# EasyEDA Pro project ProPrj_BSPD_2026-01-23.epro

# Schematic Schematic1
Board Name: Board1; Create Date: 2025-12-20; Page Name: P1; Project Name: BSPD; Schematic Name: Schematic1; Update Date: 2026-01-04; BladeWidth: 10; Company: 嘉立创EDA; Page Size: A4; RegionStart: 1; ShowBorder: 1; TitleBlock: 1; TitleBlockPosition: 3; Version: V1.0; XRegionCount: 6; YRegionCount: 4
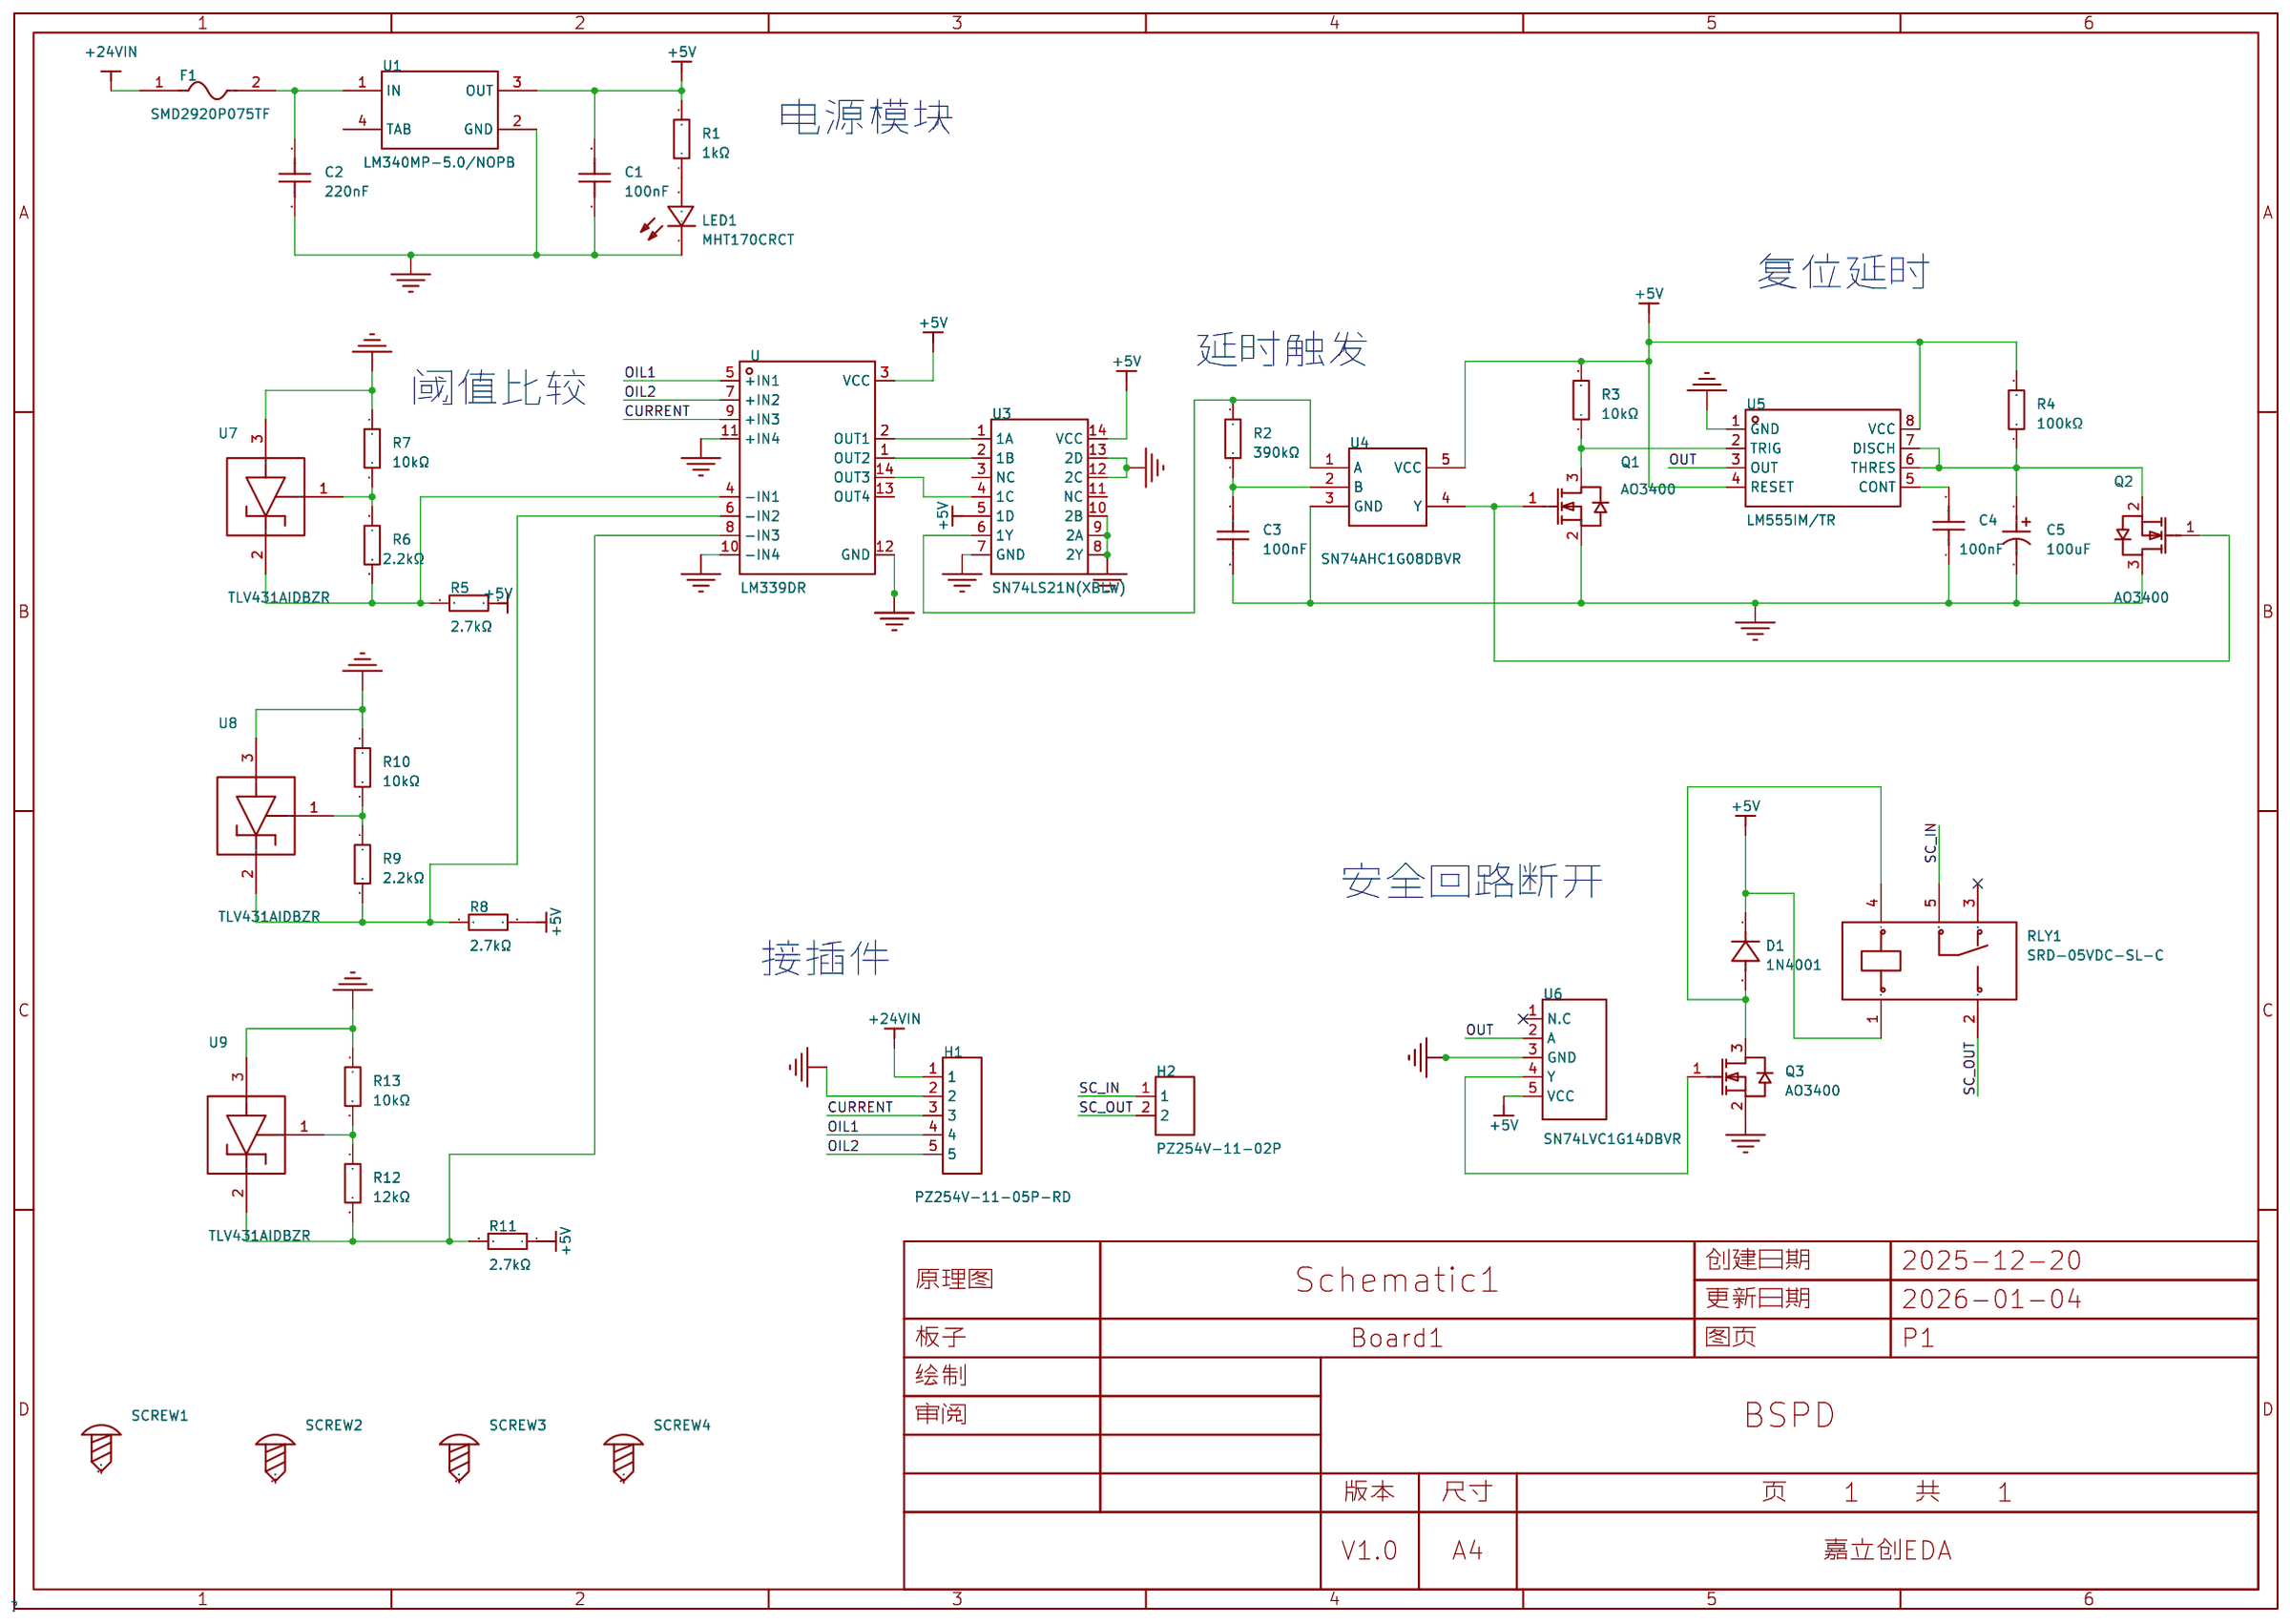
[diagram p0: schematic sheet]

## Parts
C1  100nF  [C0603]
C2  220nF  [C0603]
C3  100nF  [C0603]
C4  100nF  [C0603]
C5  100uF  [CAP-SMD_BD6.3-L6.6-W6.6-FD-1]
D1  1N4001  [SMA_L4.3-W2.5-LS5.0-RD]
F1  SMD2920P075TF  [F2920]
H1  PZ254V-11-05P-RD  [HDR-TH_5P-P2.54-V-M]
H2  PZ254V-11-02P  [HDR-TH_2P-P2.54-V-M]
LED1  MHT170CRCT  [LED0805-RD]
Q1  AO3400  [SOT-23_L2.9-W1.3-P1.90-LS2.4-BR]
Q2  AO3400  [SOT-23_L2.9-W1.3-P1.90-LS2.4-BR]
Q3  AO3400  [SOT-23_L2.9-W1.3-P1.90-LS2.4-BR]
R1  1kΩ  [R0603]
R2  390kΩ  [R0603]
R3  10kΩ  [R0603]
R4  100kΩ  [R0603]
R5  2.7kΩ  [R0603]
R6  2.2kΩ  [R0603]
R7  10kΩ  [R0603]
R8  2.7kΩ  [R0603]
R9  2.2kΩ  [R0603]
R10  10kΩ  [R0603]
R11  2.7kΩ  [R0603]
R12  12kΩ  [R0603]
R13  10kΩ  [R0603]
RLY1  SRD-05VDC-SL-C  [RELAY-TH_SRD-XXVDC-XL-C]
SCREW1  -  [M2螺丝]
SCREW2  -  [M2螺丝]
SCREW3  -  [M2螺丝]
SCREW4  -  [M2螺丝]
U  LM339DR  [SOIC-14_L8.7-W3.9-P1.27-LS6.0-BL]
U1  LM340MP-5.0/NOPB  [SOT-223_L6.5-W3.5-P2.30-LS7.0-BR]
U3  SN74LS21N(XBLW)  [DIP-14_L19.0-W6.4-P2.54-LS7.6-BL]
U4  SN74AHC1G08DBVR  [SOT-23-5_L3.0-W1.7-P0.95-LS2.8-BR]
U5  LM555IM/TR  [SOIC-8_L4.9-W3.9-P1.27-LS6.0-BL]
U6  SN74LVC1G14DBVR  [SOT-23-5_L3.0-W1.7-P0.95-LS2.8-BR]
U7  TLV431AIDBZR  [SOT-23-3_L2.9-W1.3-P1.90-LS2.4-BR]
U8  TLV431AIDBZR  [SOT-23-3_L2.9-W1.3-P1.90-LS2.4-BR]
U9  TLV431AIDBZR  [SOT-23-3_L2.9-W1.3-P1.90-LS2.4-BR]

## Library data of the parts
C1-C4 = CGA0603X7R104K500JT: 容值:100nF;精度:±10%;额定电压:50V;温度系数:X7R;; LCSC Part Name: 100nF ±10% 50V; Supplier Part: C6119867; Manufacturer: HRE(芯声); Supplier Footprint: 0603; JLCPCB Part Class: 扩展库; Datasheet: https://item.szlcsc.com/datasheet/CGA0603X7R104K500JT/7062573.html; Supplier: LCSC; Tolerance: ±10%; Voltage Rating: 50V; Temperature Coefficient: X7R
C5 = JVJ25V100M6x5: 容值:100uF;精度:±20%;额定电压:25V;纹波电流:72mA@120Hz;; LCSC Part Name: 100uF ±20% 25V; Supplier Part: C46550402; Manufacturer: JIERR(捷而瑞); Supplier Footprint: SMD,D6.3xL5.4mm; JLCPCB Part Class: 扩展库; Datasheet: https://item.szlcsc.com/datasheet/JVJ25V100M6x5/48680096.html; Supplier: LCSC; Tolerance: ±20%; Voltage Rating: 25V; Ripple Current: 72mA@120Hz; Diameter: 6.3mm; Height - Seated (Max): 5.4mm; Lifetime: 2000hrs@105℃; Operating Temperature: -55℃~+105℃
D1 = 1N4001_C727079: 二极管配置:独立式;正向压降(Vf):1.1V@1A;直流反向耐压(Vr):50V;整流电流:1A;; Supplier Part: C727079; Manufacturer: TWGMC(迪嘉); Supplier Footprint: SMA(DO-214AC); JLCPCB Part Class: 扩展库; Datasheet: https://item.szlcsc.com/datasheet/1N4001/774184.html; Supplier: LCSC; Diode Configuration: 独立式; Voltage - Forward(Vf@If): 1.1V@1A; Voltage - DC Reverse(Vr): 50V; Current - Rectified: 1A; Reverse Leakage Current (Ir): 5uA
F1 = SMD2920P075TF_C20822: 耐压(Vmax):33V;最大电流(Imax):40A;保持电流(Ihold):750mA;跳闸电流(Itrip):1.5A;; LCSC Part Name: 30V 750mA 2920自恢复; Supplier Part: C20822; Manufacturer: RUILON(瑞隆源); Supplier Footprint: 2920; JLCPCB Part Class: 扩展库; Datasheet: https://item.szlcsc.com/datasheet/SMD2920P075TF/21534.html; Supplier: LCSC; Voltage - Max: 33V; Current - Max: 40A; Hold Current: 750mA; Trip Current: 1.5A; Time to Trip(Max): 300ms; Operating Temperature: -40℃~+85℃; Length: 7.98mm; Width: 5.44mm; Height: 1.3mm
H1 = PZ254V-11-05P-RD: 插针结构:1x5P;间距:2.54mm;圆针/方针:方针;安装方式:直插;排数:单排;总PIN位数:5P;额定电流:3A;配合针长度:6.1mm;塑高:2.5mm;端接针长度:3mm;触头材质:黄铜;工作温度:-40℃~+105℃;颜色:红色;; LCSC Part Name: 1x5P 间距:2.54mm 方针 直插; Supplier Part: C41425295; Manufacturer: XFCN(兴飞); Supplier Footprint: 插件,P=2.54mm; JLCPCB Part Class: 扩展库; Datasheet: https://item.szlcsc.com/datasheet/PZ254V-11-05P-RD/43268212.html; Supplier: LCSC; Pin Structure: 1x5P; Pitch: 2.54mm; Circluar Pins/Square Pins: 方针; Mounting Type: 直插; Number of Rows: 单排; Number of Pins: 5P; Current Rating: 3A; Length of Mating Pin: 6.1mm; Insulation Height: 2.5mm; Length of End Connection Pin: 3mm; Contact Material: 黄铜; Operating Temperature: -40℃~+105℃; Color: 红色
H2 = PZ254V-11-02P: 插针结构:1x2P;间距:2.54mm;行距:-;圆针/方针:方针;安装方式:直插;排数:单排;总PIN位数:2P;额定电流:-;额定电压:-;配合针长度:6mm;塑高:2.5mm;端接针长度:3mm;触头材质:黄铜;触头镀层:-;工作温度:-40℃~+105℃;颜色:黑色;; LCSC Part Name: 1x2P 间距:2.54mm 方针 直插; Supplier Part: C492401; Manufacturer: XFCN(兴飞); Supplier Footprint: 插件,P=2.54mm; JLCPCB Part Class: 扩展库; Datasheet: https://item.szlcsc.com/datasheet/PZ254V-11-02P/502957.html; Supplier: LCSC; Pin Structure: 1x2P; Pitch: 2.54mm; Circluar Pins/Square Pins: 方针; Mounting Type: 直插; Number of Rows: 单排; Number of Pins: 2P; Length of Mating Pin: 6mm; Insulation Height: 2.5mm; Length of End Connection Pin: 3mm; Contact Material: 黄铜; Operating Temperature: -40℃~+105℃; Color: 黑色
LED1 = MHT170CRCT: 发光颜色:红色;功率:60mW；40mW;正向电流:20mA;主波长:617.5nm~633.5nm;二极管配置:-;透镜颜色:无色透明透镜;色温:-;发光角度:140°;载带方式:-;工作温度:-40℃~+85℃;; LCSC Part Name: 红灯; Supplier Part: C389523; Manufacturer: MEIHUA(美华); Supplier Footprint: 0805; JLCPCB Part Class: 扩展库; Datasheet: https://atta.szlcsc.com/upload/public/pdf/source/20190515/C389523_83CDF1F865E0603B87BA4637FE3B16EE.pdf; Supplier: LCSC; Emitted Color: 红色; Power Dissipation: 60mW；40mW; Forward Current: 20mA; Dominant Wavelength: 617.5nm~633.5nm; Peak Wavelength: 632nm; Lens Color: 无色透明透镜; Viewing Angle: 140°; Operating Temperature: -40℃~+85℃
Q1-Q3 = AO3400_C2938367: 数量:1个N沟道;漏源电压(Vdss):30V;连续漏极电流(Id):5.8A;导通电阻(RDS(on)):28mΩ@10V;耗散功率(Pd):1.5W;阈值电压(Vgs(th)):1.4V@250uA;; LCSC Part Name: 1个N沟道 耐压:30V 电流:5.8A; Supplier Part: C2938367; Manufacturer: GOODWORK(固得沃克); Supplier Footprint: SOT-23; JLCPCB Part Class: 扩展库; Datasheet: https://item.szlcsc.com/datasheet/AO3400/3294704.html; Supplier: LCSC; Number: 1个N沟道; Drain to Source Voltage: 30V; Current - Continuous Drain(Id): 5.8A; RDS(on): 28mΩ@10V; Pd - Power Dissipation: 1.5W; Gate Threshold Voltage (Vgs(th)): 1.4V@250uA; Input Capacitance(Ciss): 1.05nF; Reverse Transfer Capacitance (Crss@Vds): 77pF@15V; Operating Temperature: -55℃~+150℃; Type: N沟道
R1-R3 R5-R13 = 0603WAF1002T5E: 电阻类型:厚膜电阻;阻值:10kΩ;精度:±1%;功率:100mW;工作电压:75V;温度系数:±100ppm/℃;; LCSC Part Name: 厚膜电阻 10kΩ ±1% 100mW; Supplier Part: C25804; Manufacturer: UNI-ROYAL(厚声); Supplier Footprint: 0603; JLCPCB Part Class: 基础库; Datasheet: https://item.szlcsc.com/datasheet/0603WAF1002T5E/26547.html; Supplier: LCSC; Type: 厚膜电阻; Tolerance: ±1%; Power(Watts): 100mW; Voltage-Supply(Max): 75V; Temperature Coefficient: ±100ppm/℃; Operating Temperature: -55℃~+155℃
R4 = 0603WAF1003T5E: 电阻类型:厚膜电阻;阻值:100kΩ;精度:±1%;功率:100mW;工作电压:75V;温度系数:±100ppm/℃;; LCSC Part Name: 100kΩ ±1% 100mW 厚膜电阻; Supplier Part: C25803; Manufacturer: UNI-ROYAL(厚声); Supplier Footprint: 0603; JLCPCB Part Class: 基础库; Datasheet: https://item.szlcsc.com/datasheet/0603WAF1003T5E/26546.html; Supplier: LCSC; Type: 厚膜电阻; Tolerance: ±1%; Power(Watts): 100mW; Voltage-Supply(Max): 75V; Temperature Coefficient: ±100ppm/℃; Operating Temperature: -55℃~+155℃
RLY1 = SRD-05VDC-SL-C: 线圈电压:5V;触点形式:一组转换:1C(单刀双掷-转换);触点容量(电阻负载):-;最大切换电压:250V@AC;最大切换电流:15A;; LCSC Part Name: 蓝色 单组转换型继电器; Supplier Part: C35449; Manufacturer: 松乐; Supplier Footprint: 插件,15.6x19.2mm; JLCPCB Part Class: 扩展库; Datasheet: https://item.szlcsc.com/datasheet/SRD-05VDC-SL-C/36422.html; Supplier: LCSC; Coil Voltage: 5V; Contact Form: 一组转换:1C(单刀双掷-转换); Number of Pins: 5; Switching Voltage(Max): 250V@AC; Coil Rated Power: 360mW; Switching Current(Max): 15A; Coil Type: 无极性-单线圈; Coil Resistance: 70Ω; Contact Resistance: 100mΩ; Operate Time: 10ms; Release Time: 10ms
SCREW1-SCREW4 = M2螺丝: Supplier Footprint: 插件
U = LM339DR_C5236695: 比较器数:四路;输入失调电压(Vos):2mV;输入偏置电流(Ib):25nA;; Supplier Part: C5236695; Manufacturer: UMW(友台半导体); Supplier Footprint: SOP-14; JLCPCB Part Class: 扩展库; Datasheet: https://item.szlcsc.com/datasheet/LM339DR/5939954.html; Supplier: LCSC; Number of Channels: 四路; Vos - Input Offset Voltage: 2mV; Ib - Input Bias Current: 25nA; Propagation Delay Time: 300ns; Output Mode: TTL；CMOS; Quiescent Current: 800uA; Operating Temperature: 0℃~+70℃; Maximum Power Supply Range (Vdd-Vss): 36V; Single Supply: 2V~36V; Dual Supply: 1V~18V；-18V~-1V; Input Offset Current(Ios): 5nA; Response Time (tr): 1.3us
U1 = LM340MP-5.0/NOPB: 输出类型:固定;工作电压:35V;输出电压:5V;输出电流:1A;电源纹波抑制比(PSRR):70dB@(120Hz);输出极性:正极;; LCSC Part Name: 1.5A、35V 线性稳压器; Supplier Part: C131990; Manufacturer: TI(德州仪器); Supplier Footprint: SOT-223; JLCPCB Part Class: 扩展库; Datasheet: https://www.ti.com/cn/lit/gpn/lm340; Supplier: LCSC; Output Type: 固定; Voltage - Supply: 35V; Output Voltage: 5V; Output Current: 1A; Power Supply Rejection Ratio (PSRR): 70dB@(120Hz); Voltage Dropout: 2V@(1A); standby current: 8mA; Noise: 40uV; Features: 短路保护；过热保护；过流保护; Operating Temperature: 0℃~+125℃; Output Configuration: 正极; Number of Outputs: 1
U3 = SN74LS21N(XBLW): 逻辑类型:与门;通道数:2;工作电压:2V~6V;静态电流(Iq):20uA;传播延迟(tpd):19ns@6.0V,50pF;; LCSC Part Name: 双路四输入与门; Supplier Part: C42395511; Manufacturer: XBLW(芯伯乐); Supplier Footprint: DIP-14; JLCPCB Part Class: Extended Part; Datasheet: https://item.szlcsc.com/datasheet/SN74LS21N(XBLW)/44341345.html; Supplier: LCSC; Logic Type: 与门; Number of Channels: 2; Voltage - Supply: 2V~6V; Quiescent Current: 20uA; Current - Output Low(IOL): 5.2mA; Current - Output High(IOH): 5.2mA; Input Logic Level - High: 1.5V；4.2V；3.15V; Input Logic Level - Low: 500mV；1.35V；1.8V; Output Logic Level - High: 1.9V；5.48V；3.98V; Output Logic Level - Low: 100mV；330mV；330mV; Series: 74LS; Propagation Delay: 19ns@6.0V,50pF; Operating Temperature: -20℃~+85℃; Input Number: 4
U4 = SN74AHC1G08DBVR: 逻辑类型:与门;通道数:1;工作电压:2V~5.5V;静态电流(Iq):1uA;传播延迟(tpd):7.9ns@5V,50pF;; Supplier Part: C7467; Manufacturer: TI(德州仪器); Supplier Footprint: SOT-23-5; JLCPCB Part Class: 扩展库; Datasheet: https://www.ti.com/cn/lit/gpn/sn74ahc1g08; Supplier: LCSC; Logic Type: 与门; Number of Channels: 1; Voltage - Supply: 2V~5.5V; Quiescent Current: 1uA; Current - Output Low(IOL): 8mA; Current - Output High(IOH): 8mA; Input Logic Level - High: 1.5V~3.85V; Input Logic Level - Low: 500mV~1.65V; Series: 74AHC系列; Propagation Delay: 7.9ns@5V,50pF; Operating Temperature: -55℃~+125℃
U5 = LM555IM/TR: 定时器/计时器/时钟振荡器  高精度定时脉冲的双极性集成电路; Supplier Part: C19193454; Manufacturer: HGSEMI(华冠); Supplier Footprint: SOP-8; JLCPCB Part Class: Extended Part; Datasheet: https://item.szlcsc.com/datasheet/LM555IM%252FTR/20442266.html; Supplier: LCSC
U6 = SN74LVC1G14DBVR: 输入类型:施密特触发器;工作电压:1.65V~5.5V;工作电流:10uA;通道数:1;传播延迟(tpd):6.5ns@2.5V,50pF;; LCSC Part Name: 单路施密特触发反相器; Supplier Part: C7835; Manufacturer: TI(德州仪器); Supplier Footprint: SOT-23-5; JLCPCB Part Class: 扩展库; Datasheet: https://www.ti.com/cn/lit/gpn/sn74lvc1g14; Supplier: LCSC; Input Type: 施密特触发器; Voltage - Supply: 1.65V~5.5V; Current - Supply: 10uA; Number of Circuits: 1; Number of Inputs: 1; Current - Output Low(IOL): 32mA; Current - Output High(IOH): 32mA; Input Logic Level - High: 1.16V~3.33V; Input Logic Level -Low: 390mV~1.87V; Max Propagation Delay: 6.5ns@2.5V,50pF; Series: 74LVC系列
U7-U9 = TLV431AIDBZR: 输出类型:可调;输出电压:1.24V~6V;输出电流:15mA;精度:±1%;; LCSC Part Name: 低压可调精密并联稳压器; Supplier Part: C56765; Manufacturer: TI(德州仪器); Supplier Footprint: SOT-23; JLCPCB Part Class: 扩展库; Datasheet: https://www.ti.com/cn/lit/gpn/tlv431a; Supplier: LCSC; Output Type: 可调; Output Voltage: 1.24V~6V; Output Current: 15mA; Tolerance: ±1%; Reference Type: 并联; Minimum Cathode Current for Regulation: 100uA; Operating Temperature: -40℃~+85℃

## Nets
+5V: C1.2 D1.1(K) R1.2 R3.2 R4.2 R5.1 R8.1 R11.1 RLY1.1 U.3(VCC) U1.3(OUT) U3.5(1D) U3.14(VCC) U4.5(VCC) U5.4(RESET) U5.8(VCC) U6.5(VCC)
+24VIN: F1.1 H1.1
GND: C1.1 C2.2 C3.2 C4.1 C5.2 H1.2 LED1.1(-) Q1.2(S) Q2.3(D) Q3.2(S) R7.1 R10.1 R13.1 U.10(-IN4) U.11(+IN4) U.12(GND) U1.2(GND) U3.7(GND) U3.8(2Y) U3.9(2A) U3.10(2B) U3.12(2C) U3.13(2D) U4.3(GND) U5.1(GND) U6.3(GND) U7.3(A) U8.3(A) U9.3(A)
CURRENT: H1.3 U.9(+IN3)
OIL1: H1.4 U.5(+IN1)
OIL2: H1.5 U.7(+IN2)
OUT: U5.3(OUT) U6.2(A)
SC_IN: H2.1 RLY1.5
SC_OUT: H2.2 RLY1.2
$1N394: C2.1 F1.2 U1.1(IN)
$1N3641: U.2(OUT1) U3.1(1A)
$1N3645: U.1(OUT2) U3.2(1B)
$1N3650: U.14(OUT3) U3.4(1C)
$1N3824: R2.2 U3.6(1Y) U4.1(A)
$1N4014: LED1.2(+) R1.1
$1N4204: C3.1 R2.1 U4.2(B)
$1N5455: Q1.3(D) R3.1 U5.2(TRIG)
$1N5481: Q1.1(G) Q2.1(G) U4.4(Y)
$1N5592: C5.1 Q2.2(S) R4.1 U5.6(THRES) U5.7(DISCH)
$1N5609: C4.2 U5.5(CONT)
$1N6118: Q3.1(G) U6.4(Y)
$1N6220: D1.2(A) Q3.3(D) RLY1.4
$1N7976: R6.1 R7.2 U7.1(REF)
$1N8357: R5.2 R6.2 U.4(-IN1) U7.2(C)
$1N8749: R11.2 R12.2 U.8(-IN3) U9.2(C)
$1N11432: R8.2 R9.2 U.6(-IN2) U8.2(C)
$1N11437: R9.1 R10.2 U8.1(REF)
$1N11462: R12.1 R13.2 U9.1(REF)

Not connected (* = marked no-connect by the designer): RLY1 3*; SCREW1 1; SCREW2 1; SCREW3 1; SCREW4 1; U 13(OUT4); U1 4(TAB); U3 3(NC) 11(NC); U6 1(N.C)*

## Notes on the sheet
- 电源模块
- 复位延时
- 延时触发
- 阈值比较
- 安全回路断开
- 接插件

# Board PCB1
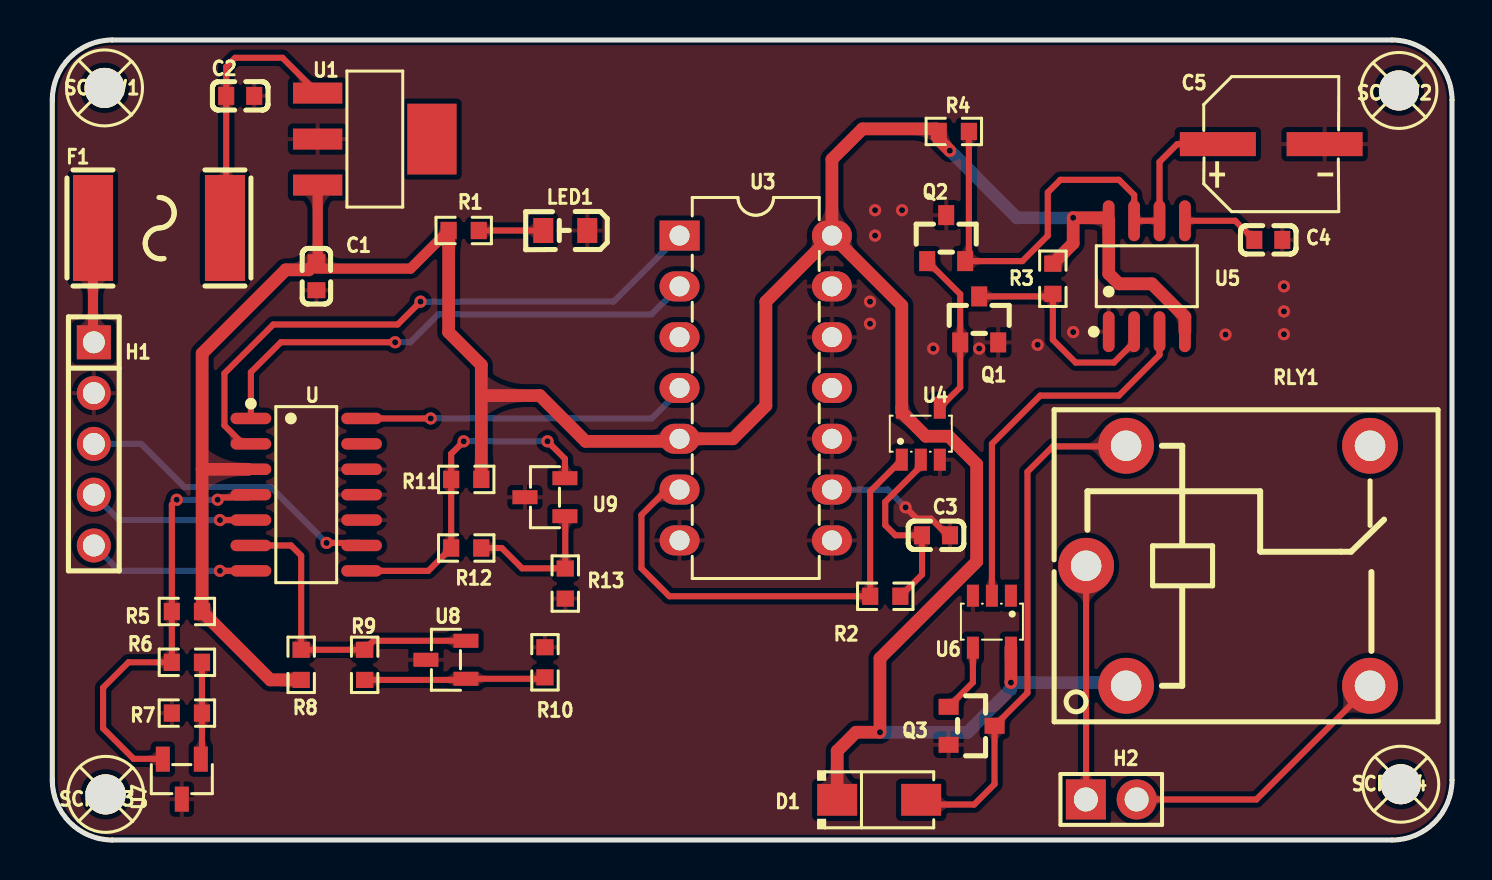
[diagram p1: board, top side]
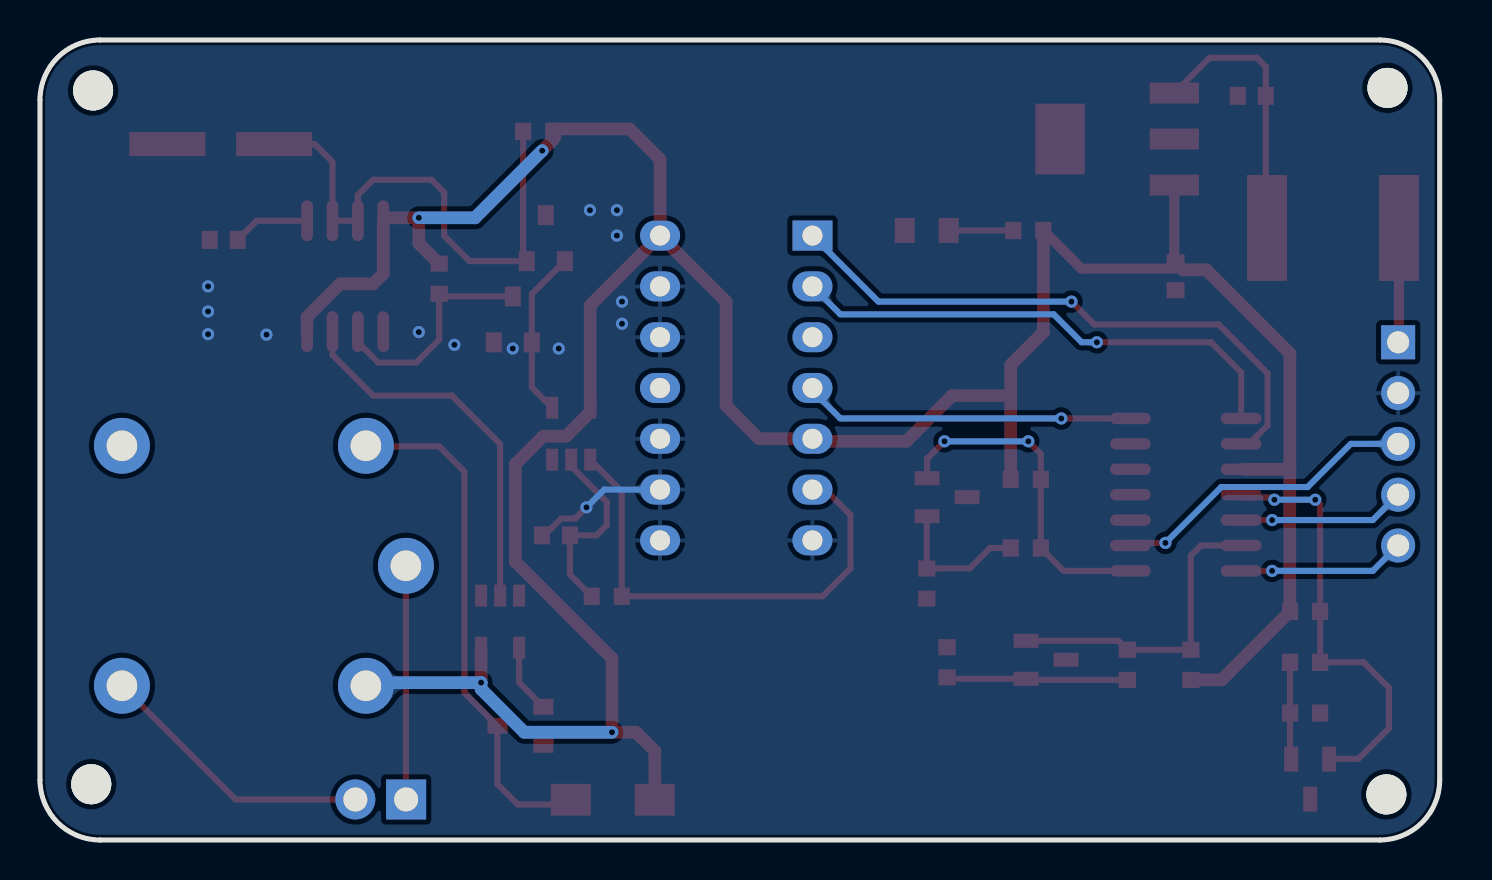
[diagram p2: board, bottom side, seen from below]

Outline 70 x 40 mm; copper layers: Top Layer, Bottom Layer. Coordinates in mm from the lower left corner of the outline.
Outline path: 0,37 0,3 arc(0.88,0.88) 3,0 67,0 arc(69.12,0.88) 70,3 70,37 arc(69.12,39.12) 67,40 3,40 arc(0.88,39.12) 0,37
Stack: Top Layer 0.035mm / Dielectric1 1.51mm FR4 er 4.5 / Bottom Layer 0.035mm

## Design rules (mm)
spacing copperThickness1oz (default): track to track 0.102, other pairs 0.152 to 0.3
spacing copperThickness2oz: track to track 0.203, other pairs 0.152 to 0.3
spacing Plane_innerPlane: track to track 0.102, other pairs 0.152 to 0.3
spacing Copper_copperRegion: track to track 0.102, other pairs 0.152 to 0.3
track width copperThickness1oz (default): min 0.127, default 0.254, max 2.54
track width copperThickness2oz: min 0.203, default 0.254, max 2.54
differential pair differentialPair (default): width min 0.127, default 0.254, max 2.54; gap min 0.152, default 0.152
net GND uses copperRegion_copperThickness1oz
pour e394 uses Copper_copperRegion, copperRegion_Copper_copperRegion
pour e495 uses Copper_copperRegion, copperRegion_Copper_copperRegion

## Placement (name value [footprint] x y rotation side)
C1  100nF  [C0603]  13.21 28.19 90 top
C2  220nF  [C0603]  9.4 37.21 0 top
C3  100nF  [C0603]  44.2 15.23 0 top
C4  100nF  [C0603]  60.81 30.01 180 top
C5  100uF  [CAP-SMD_BD6.3-L6.6-W6.6-FD-1]  60.96 34.79 0 top
D1  1N4001  [SMA_L4.3-W2.5-LS5.0-RD]  41.35 2.01 0 top
F1  SMD2920P075TF  [F2920]  5.33 30.6 0 top
H1  PZ254V-11-05P-RD  [HDR-TH_5P-P2.54-V-M]  2.08 19.81 270 top
H2  PZ254V-11-02P  [HDR-TH_2P-P2.54-V-M]  52.96 2.03 0 top
LED1  MHT170CRCT  [LED0805-RD]  25.65 30.47 180 top
Q1  AO3400  [SOT-23_L2.9-W1.3-P1.90-LS2.4-BR]  46.35 26.03 270 top
Q2  AO3400  [SOT-23_L2.9-W1.3-P1.90-LS2.4-BR]  44.7 30.09 270 top
Q3  AO3400  [SOT-23_L2.9-W1.3-P1.90-LS2.4-BR]  45.97 5.71 180 top
R1  1kΩ  [R0603]  20.57 30.47 180 top
R2  390kΩ  [R0603]  41.66 12.19 180 top
R3  10kΩ  [R0603]  50.04 28.06 90 top
R4  100kΩ  [R0603]  45.09 35.43 180 top
R5  2.7kΩ  [R0603]  6.73 11.42 180 top
R6  2.2kΩ  [R0603]  6.73 8.89 180 top
R7  10kΩ  [R0603]  6.73 6.34 0 top
R8  2.7kΩ  [R0603]  12.45 8.76 90 top
R9  2.2kΩ  [R0603]  15.62 8.76 90 top
R10  10kΩ  [R0603]  24.64 8.89 270 top
R11  2.7kΩ  [R0603]  20.7 18.03 180 top
R12  12kΩ  [R0603]  20.7 14.6 180 top
R13  10kΩ  [R0603]  25.65 12.82 90 top
RLY1  SRD-05VDC-SL-C  [RELAY-TH_SRD-XXVDC-XL-C]  58.8 13.71 0 top
SCREW1  -  [M2螺丝]  2.61 37.6 0 top
SCREW2  -  [M2螺丝]  67.34 37.48 0 top
SCREW3  -  [M2螺丝]  2.67 2.28 0 top
SCREW4  -  [M2螺丝]  67.44 2.79 0 top
U  LM339DR  [SOIC-14_L8.7-W3.9-P1.27-LS6.0-BL]  12.7 17.27 270 top
U1  LM340MP-5.0/NOPB  [SOT-223_L6.5-W3.5-P2.30-LS7.0-BR]  16.13 35.05 180 top
U3  SN74LS21N(XBLW)  [DIP-14_L19.0-W6.4-P2.54-LS7.6-BL]  35.18 22.6 270 top
U4  SN74AHC1G08DBVR  [SOT-23-5_L3.0-W1.7-P0.95-LS2.8-BR]  43.43 20.31 270 top
U5  LM555IM/TR  [SOIC-8_L4.9-W3.9-P1.27-LS6.0-BL]  54.74 28.19 0 top
U6  SN74LVC1G14DBVR  [SOT-23-5_L3.0-W1.7-P0.95-LS2.8-BR]  46.99 10.92 90 top
U7  TLV431AIDBZR  [SOT-23-3_L2.9-W1.3-P1.90-LS2.4-BR]  6.48 3.04 90 top
U8  TLV431AIDBZR  [SOT-23-3_L2.9-W1.3-P1.90-LS2.4-BR]  19.69 9.01 0 top
U9  TLV431AIDBZR  [SOT-23-3_L2.9-W1.3-P1.90-LS2.4-BR]  24.64 17.14 0 top

## Footprints (pads in the part's own frame, mm; a bottom-side part is the same pattern mirrored in y, then rotated)
C0603
  rect 0.8x0.9 smd: 1(-0.7,0) 2(0.7,0)
CAP-SMD_BD6.3-L6.6-W6.6-FD-1
  rect 3.8x1.2 smd: 1(-2.67,0) 2(2.67,0)
DIP-14_L19.0-W6.4-P2.54-LS7.6-BL
  rect 1.5x2 hole 1: 1(-7.62,-3.81)
  oval 1.5x2 hole 1: 2(-5.08,-3.81) 3(-2.54,-3.81) 4(0,-3.81) 5(2.54,-3.81) 6(5.08,-3.81) 7(7.62,-3.81) 8(7.62,3.81) 9(5.08,3.81) 10(2.54,3.81) 11(0,3.81) 12(-2.54,3.81) 13(-5.08,3.81) 14(-7.62,3.81)
F2920
  rect 2x5.3 smd: 1(-3.3,0) 2(3.3,0)
HDR-TH_2P-P2.54-V-M
  rect 2x2 hole 1.2: 1(-1.27,0)
  round 2 hole 1.2: 2(1.27,0)
HDR-TH_5P-P2.54-V-M
  rect 1.7x1.7 hole 1.1: 1(-5.08,0)
  round 1.7 hole 1.1: 2(-2.54,0) 3(0,0) 4(2.54,0) 5(5.08,0)
LED0805-RD
  rect 1x1.25 smd: 1(-1.1,0) 2(1.1,0)
M2螺丝
  round 2 hole 2: 1(0,0)
R0603
  rect 0.806x0.864 smd: 1(-0.753,0) 2(0.753,0)
RELAY-TH_SRD-XXVDC-XL-C
  round 2.794 hole 1.524: 1(-5.1,-6) 2(7.1,-6) 3(7.1,6) 4(-5.1,6) 5(-7.1,0)
SMA_L4.3-W2.5-LS5.0-RD
  rect 2x1.593 smd: 1(-2.1,0) 2(2.1,0)
SOIC-8_L4.9-W3.9-P1.27-LS6.0-BL
  oval 0.588x2.045 smd: 1(-1.905,-2.772) 2(-0.635,-2.772) 3(0.635,-2.772) 4(1.905,-2.772) 5(1.905,2.772) 6(0.635,2.772) 7(-0.635,2.772) 8(-1.905,2.772)
SOIC-14_L8.7-W3.9-P1.27-LS6.0-BL
  oval 0.574x2.038 smd: 1(-3.81,-2.769) 2(-2.54,-2.769) 3(-1.27,-2.769) 4(0,-2.769) 5(1.27,-2.769) 6(2.54,-2.769) 7(3.81,-2.769) 8(3.81,2.769) 9(2.54,2.769) 10(1.27,2.769) 11(0,2.769) 12(-1.27,2.769) 13(-2.54,2.769) 14(-3.81,2.769)
SOT-23-3_L2.9-W1.3-P1.90-LS2.4-BR
  rect 1.25x0.7 smd: 1(1,-0.95) 2(1,0.95) 3(-1,0)
SOT-23-5_L3.0-W1.7-P0.95-LS2.8-BR
  rect 1.1x0.6 smd: 1(1.3,-0.95) 2(1.3,0) 3(1.3,0.95) 4(-1.3,0.95) 5(-1.3,-0.95)
SOT-23_L2.9-W1.3-P1.90-LS2.4-BR
  rect 1x0.8 smd: 1(1.15,-0.95) 2(1.15,0.95) 3(-1.15,0)
SOT-223_L6.5-W3.5-P2.30-LS7.0-BR
  rect 2.465x1.05 smd: 1(2.857,-2.3) 2(2.857,0) 3(2.857,2.3)
  rect 2.465x3.54 smd: 4(-2.857,0)

## Nets
As in the schematic.

Pads without a net: RLY1 3; SCREW1 1; SCREW2 1; SCREW3 1; SCREW4 1; U 13; U1 4; U3 3 11; U6 1

## Via types
v1: diameter 0.61, hole 0.305, Top Layer to Bottom Layer, 28 vias

## Routing (per net, layer and track width the routed paths; a pad name or vN(x,y) marks a point on that pad's centre or on a via; arc(x,y) is an arc through that point)
+5V: length 161.3
  Top Layer w0.508: R1.2 17.92,28.57 13.21,28.57 ; U1.3 13.27,28.89
  Top Layer w0.635: R1.2 19.82,25.39 21.45,23.75 21.45,22.22 ; R5.1 10.9,8 R8.1 ; R3.2 51.05,29.83 v1(51.05,31.11) 52.68,31.11 U5.8 52.83,28.32 53.34,27.81 54.99,27.81 56.64,26.16 U5.4 ; 21.45,22.22 24.38,22.22 26.67,19.93 31.24,19.93 U3.5 34.04,20.06 35.69,21.71 35.69,26.92 U3.14 ; 21.45,22.22 R11.1 ; U6.5 v1(47.94,7.87) ; 7.49,18.53 7.49,24.33 11.67,28.51 12.83,28.51 C1.2 ; 7.49,18.53 9.81,18.53 ; 7.49,18.53 7.49,11.54 ; v1(44.88,34.47) 44.33,35.02 R4.2 44.2,35.56 40.51,35.56 38.99,34.03 U3.14 ; U3.14 42.48,26.73 U4.5 42.48,21.39 43.69,20.19 44.83,20.19 46.23,18.79 46.23,13.92 41.39,9.08 v1(41.39,5.39) 40.19,5.39 39.25,4.45 D1.1
  Bottom Layer w0.635: v1(44.88,34.47) 48.24,31.11 v1(51.05,31.11) ; v1(41.39,5.39) 45.78,5.39 47.94,7.55 v1(47.94,7.87) 53.54,7.87 RLY1.1
+24VIN: length 5.7
  Top Layer w0.508: F1.1 2.03,24.93 H1.1
GND: length 6.9
  Top Layer w0.305: v1(42.67,16.63) 43.24,16.07 43.94,16.07 44.78,15.23 C3.2
  Bottom Layer w0.305: U3.9 41.78,17.52 v1(42.67,16.63)
  vias: v1(40.89,26.92) v1(40.89,25.81) v1(41.15,31.49) v1(41.15,30.22) v1(42.5,31.49) v1(44.06,24.57) v1(46.35,24.57) v1(49.28,24.76) v1(51.05,25.39) v1(58.67,25.27) v1(61.59,27.68) v1(61.59,26.43) v1(61.59,25.29)
CURRENT: length 15.5
  Top Layer w0.305: 15.47,14.73 15.34,14.85 v1(13.72,14.85)
  Bottom Layer w0.305: v1(13.72,14.85) 10.92,17.65 6.6,17.65 4.45,19.81 H1.3
OIL1: length 8.4
  Top Layer w0.305: U.5 v1(8.38,16)
  Bottom Layer w0.305: v1(8.38,16) 3.35,16 H1.4
OIL2: length 8.4
  Top Layer w0.305: U.7 v1(8.38,13.46)
  Bottom Layer w0.305: v1(8.38,13.46) 3.35,13.46 H1.5
OUT: length 19
  Top Layer w0.305: U5.3 55.37,24.25 53.34,22.22 49.4,22.22 46.99,19.81 U6.2
SC_IN: length 11.7
  Top Layer w0.305: H2.1 51.7,2.04 RLY1.5
SC_OUT: length 14.1
  Top Layer w0.305: 54.15,2.03 60.22,2.03 RLY1.2
$1N394: length 13.6
  Top Layer w0.305: U1.1 11.51,39.11 9.14,39.11 8.7,38.67 C2.1 8.7,30.67 F1.2
$1N3641: length 29.7
  Top Layer w0.305: U.2 9.53,19.81 8.61,20.73 8.61,23.33 11.05,25.78 17.27,25.78 v1(18.41,26.92)
  Bottom Layer w0.305: 31.24,30.09 28.07,26.92 v1(18.41,26.92)
$1N3645: length 25.3
  Top Layer w0.305: v1(17.14,24.89) 11.43,24.89 9.93,23.39 U.1
  Bottom Layer w0.305: v1(17.14,24.89) 17.91,24.89 19.3,26.28 29.97,26.28 31.24,27.55
$1N3650: length 16.5
  Top Layer w0.305: 15.47,21.08 v1(18.92,21.08)
  Bottom Layer w0.305: 31.37,22.47 29.97,21.08 v1(18.92,21.08)
$1N3824: length 24.6
  Top Layer w0.305: U3.6 30.73,17.52 29.46,16.25 29.46,13.58 30.86,12.19 R2.2 40.9,17.43 U4.1
$1N4014: length 3.2
  Top Layer w0.305: R1.1 LED1.2
$1N4204: length 9.6
  Top Layer w0.305: R2.1 43.5,13.27 C3.1 42.16,15.23 41.66,15.74 41.66,16.91 43.43,18.68 U4.2
$1N5455: length 11.5
  Top Layer w0.305: U5.2 54.1,24.89 53.09,23.87 51.18,23.87 50.04,25.01 R3.1 49.91,27.18 Q1.3
$1N5481: length 8.4
  Top Layer w0.305: Q2.1 45.41,27.29 Q1.1 45.41,22.64 U4.4
$1N5592: length 27.1
  Top Layer w0.305: C5.1 56.26,34.79 55.37,33.9 U5.6 U5.7 54.11,30.97 54.11,32.25 53.34,33.01 50.41,33.01 49.78,32.38 49.78,30.21 48.51,28.94 Q2.2 45.84,29.13 R4.1
$1N5609: length 3.9
  Top Layer w0.305: C4.2 59.16,30.96 U5.5
$1N6118: length 3.5
  Top Layer w0.305: Q3.1 46.04,7.88 U6.4
$1N6220: length 26
  Top Layer w0.305: 43.45,2.01 43.69,1.77 46.1,1.77 47.12,2.8 Q3.3 48.77,7.35 48.77,18.41 50.04,19.68 53.67,19.68 RLY1.4
$1N7976: length 4.9
  Top Layer w0.305: R6.1 R7.2 7.48,4.1 U7.1
$1N8357: length 21.7
  Top Layer w0.305: U7.2 5.51,4.06 4.06,4.06 2.54,5.58 2.54,7.61 3.81,8.89 R6.2 R5.2 5.98,16.77 v1(6.22,17.01) ; U.4 9.79,17.13 8.38,17.13 v1(8.27,17.01)
  Bottom Layer w0.305: v1(6.22,17.01) v1(8.27,17.01)
$1N8749: length 16.9
  Top Layer w0.305: U9.2 25.64,19.06 v1(24.76,19.93) ; v1(20.57,19.93) 19.95,19.31 R11.2 R12.2 18.8,13.46 15.47,13.46
  Bottom Layer w0.305: v1(20.57,19.93) v1(24.76,19.93)
$1N11432: length 15.9
  Top Layer w0.305: U8.2 16.07,9.96 R9.2 R8.2 12.45,14.22 11.94,14.73 9.93,14.73
$1N11437: length 9.1
  Top Layer w0.305: R9.1 20.63,8 U8.1 24.57,8.06 R10.2
$1N11462: length 6.7
  Top Layer w0.305: R13.2 25.65,16.17 U9.1 ; R12.1 22.48,14.6 23.5,13.58 25.14,13.58 25.15,13.58

## Copper pours and planes (outline as drawn; the poured copper is in the pictures)
GND on Top Layer: -0.29,40 70.49,40 70.49,-0.13 -0.29,-0.13
GND on Bottom Layer: -0.25,40.38 70.87,40.38 70.87,0 -0.25,0

Small or netless copper shapes (teardrops, artwork), in the pictures only: 114 on Top Layer, 17 on Bottom Layer
